# Altium schematic sheet SAMD20_Xplained_Pro_TopLevel.SchDoc: Top Level Schematics
size A3; Organization: ATMEL Norway; Address1: Vestre Rosten 79; Address2: N-7075 TILLER; Address3: NORWAY; DocumentNumber: A09-1873; Revision: 6; SheetNumber: 1; SheetTotal: 6; PageSetup: Record=PageOptions|CenterHorizontal=True|CenterVertical=True|PrintScale=1.01|XCorrection=1.00|YCorrection=1.00|PrintKind=1|BorderSize=5000000|LeftOffset=0|BottomOffset=0|Orientation=2|PaperLength=1000|PaperWidth=1000|Scale=100|PaperSource=7|PrintQuality=-4|MediaType=1|DitherType=10|PaperKind=Letter|PrintScaleMode=1
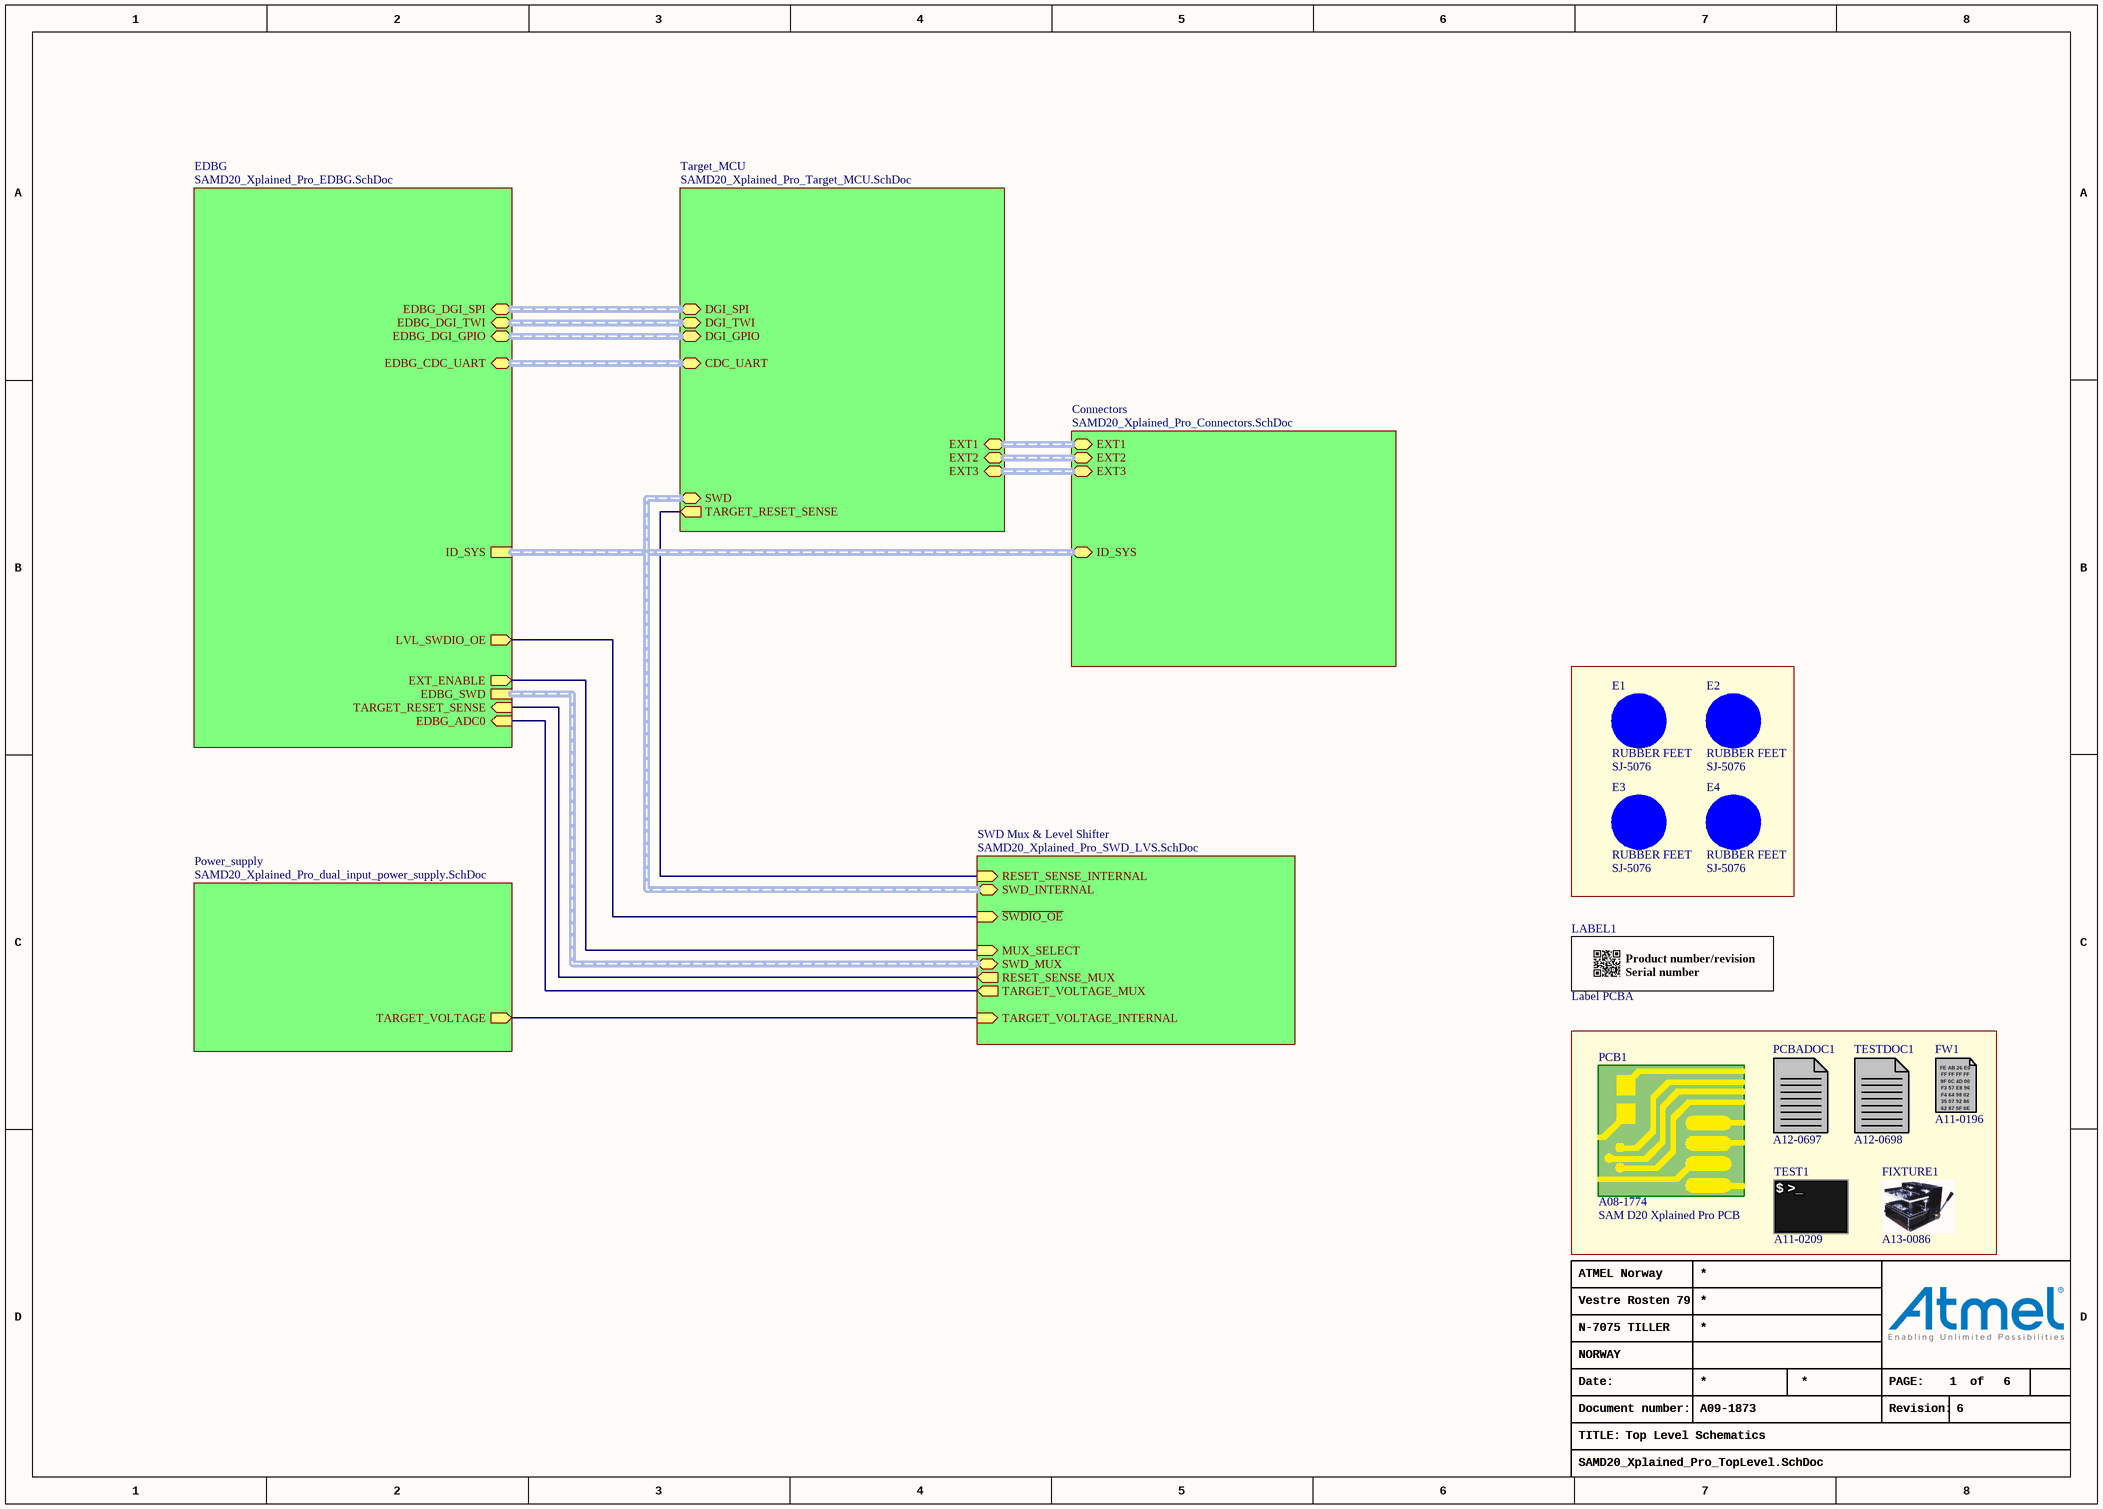
[diagram p0: SAMD20_Xplained_Pro_TopLevel.SchDoc]

## Parts
E1  RUBBER FEET  value SJ-5076  [AP8-00192]
E2  RUBBER FEET  value SJ-5076  [AP8-00192]
E3  RUBBER FEET  value SJ-5076  [AP8-00192]
E4  RUBBER FEET  value SJ-5076  [AP8-00192]
FIXTURE1  AN: A13-0086  (hidden comment: JIG)  (mechanical)
FW1  AN: A11-0196  (hidden comment: FW)  (mechanical)
LABEL1  value Label PCBA  [AP8-00317]  (hidden comment: PCBA_LABEL)
PCB1  value SAM D20 Xplained Pro PCB  AN: A08-1774  (hidden comment: PCB)  (mechanical)
PCBADOC1  AN: A12-0697  (hidden comment: DOCUMENTATION)  (mechanical)
TEST1  AN: A11-0209  (hidden comment: TEST)  (mechanical)
TESTDOC1  AN: A12-0698  (hidden comment: TESTDOC)  (mechanical)

## Sub-sheets
Connectors = SAMD20_Xplained_Pro_Connectors.SchDoc: ID_SYS (harness ID_SYS), EXT1 (harness EXT), EXT3 (harness EXT), EXT2 (harness EXT)
EDBG = SAMD20_Xplained_Pro_EDBG.SchDoc: ID_SYS (harness ID_SYS), EDBG_SWD (harness SWD), EDBG_CDC_UART (harness CDC_UART), EDBG_DGI_TWI (harness DGI_TWI), EDBG_DGI_SPI (harness DGI_SPI), EDBG_DGI_GPIO (harness DGI_GPIO), TARGET_RESET_SENSE (in), EDBG_ADC0 (in), EXT_ENABLE (out), LVL_SWDIO_OE (out)
Power_supply = SAMD20_Xplained_Pro_dual_input_power_supply.SchDoc: TARGET_VOLTAGE (out)
SWD Mux & Level Shifter = SAMD20_Xplained_Pro_SWD_LVS.SchDoc: ~{SWDIO_OE} (in), TARGET_VOLTAGE_MUX (out), SWD_MUX (harness SWD), SWD_INTERNAL (harness SWD), RESET_SENSE_MUX (out), MUX_SELECT (in), RESET_SENSE_INTERNAL (in), TARGET_VOLTAGE_INTERNAL (in)
Target_MCU = SAMD20_Xplained_Pro_Target_MCU.SchDoc: SWD (harness SWD), DGI_SPI (harness DGI_SPI), DGI_TWI (harness DGI_TWI), DGI_GPIO (harness DGI_GPIO), CDC_UART (harness CDC_UART), TARGET_RESET_SENSE (out), EXT2 (harness EXT), EXT3 (harness EXT), EXT1 (harness EXT)

## Nets
(unnamed): sheet Target_MCU/TARGET_RESET_SENSE, sheet SWD Mux & Level Shifter/RESET_SENSE_INTERNAL
(unnamed): sheet EDBG/TARGET_RESET_SENSE, sheet SWD Mux & Level Shifter/RESET_SENSE_MUX
(unnamed): sheet EDBG/EDBG_ADC0, sheet SWD Mux & Level Shifter/TARGET_VOLTAGE_MUX
(unnamed): sheet EDBG/EXT_ENABLE, sheet SWD Mux & Level Shifter/MUX_SELECT
(unnamed): sheet EDBG/LVL_SWDIO_OE, sheet SWD Mux & Level Shifter/~{SWDIO_OE}
(unnamed): sheet Power_supply/TARGET_VOLTAGE, sheet SWD Mux & Level Shifter/TARGET_VOLTAGE_INTERNAL

Not connected (* = marked no-connect by the designer): E1 1(FIDUCIAL); E2 1(FIDUCIAL); E3 1(FIDUCIAL); E4 1(FIDUCIAL)

## Buses and harness runs
harness sheet Connectors/EXT1 = sheet Target_MCU/EXT1
harness sheet Connectors/EXT2 = sheet Target_MCU/EXT2
harness sheet Connectors/EXT3 = sheet Target_MCU/EXT3
harness sheet Connectors/ID_SYS = sheet EDBG/ID_SYS
harness sheet EDBG/EDBG_CDC_UART = sheet Target_MCU/CDC_UART
harness sheet EDBG/EDBG_DGI_GPIO = sheet Target_MCU/DGI_GPIO
harness sheet EDBG/EDBG_DGI_SPI = sheet Target_MCU/DGI_SPI
harness sheet EDBG/EDBG_DGI_TWI = sheet Target_MCU/DGI_TWI
harness sheet EDBG/EDBG_SWD = sheet SWD Mux & Level Shifter/SWD_MUX
harness sheet SWD Mux & Level Shifter/SWD_INTERNAL = sheet Target_MCU/SWD

## Notes on the sheet
- Date:
- PAGE:
- of
- TITLE:
- Document number:
- Revision:
- (in symbol A09-0611) / Product number/revision / Serial number
- (in symbol A11-0196) FE AB 26 E0; FF FF FF FF; 9F 0C 4D 00; F3 57 E8 96; F4 64 98 02; 35 07 92 86; 62 87 5F 0E
- (in symbol A11-0209) $ >_

## Library data of the parts
E1-E4 = A08-0053: 2.8mm adhesive feet,diam 8.0mm; PartGroup: Mechanical devices,Mounting accessories; Manufacturer: 3M; AN: A08-0053; Height: 2,79999995231628; MPN: SJ-5076
FIXTURE1 = A13-0086: Xplained PRO MCU board Jupiter Test Fixture; PartGroup: Test Equipment,Test Fixtures; Manufacturer: ESCATEC; Value: Xplained PRO MCU board Jupiter Test Fixture; MPN: Xplained PRO MCU board Jupiter Test Fixture
FW1 = A11-0196: EDBG secured firmware; PartGroup: Software,Firmware,Tools; Manufacturer: ATMEL; Value: EDBG secured firmware
LABEL1 = A09-0611: PCBA identification label PP Top White Gloss; PartGroup: Mechanical devices,Packaging materials,Printed Labels; Manufacturer: ACT Logimark AS; MPN: 505462; AN: A09-0611
PCB1 = A08-1774: SAM D20 Xplained Pro PCB, 4 layer, 60mm x 100mm; PartGroup: Mechanical devices,Printed circuit boards
PCBADOC1 = A12-0697: SAM D20 Xplained Pro PCBA documentation; PartGroup: Documentation,PCBA Documents,Atmel; Manufacturer: ATMEL; Value: A09-1978 PCBA Files
TEST1 = A11-0209: Fixture eggTest for SAM D20 Xplained Pro; PartGroup: Software,Test software,Starter Kit; Manufacturer: ATMEL; Value: SAM D20 Xplained Pro test
TESTDOC1 = A12-0698: SAM D20 Xplained Pro Test Instructions; PartGroup: Documentation,Procedures,Test Instructions; Manufacturer: ATMEL; Value: SAM D20 Xplained Pro Test Instructions